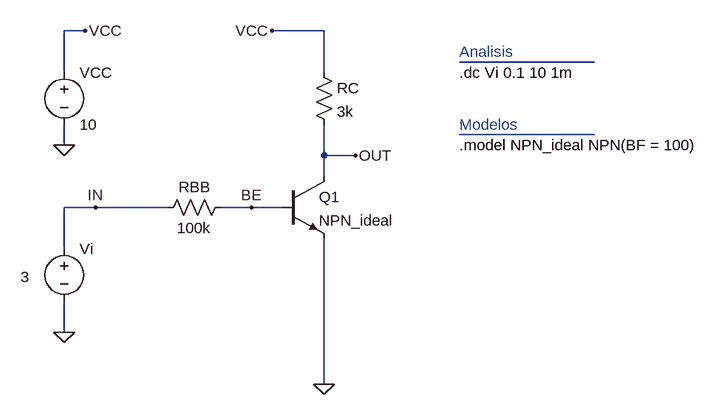
[diagram p0: schematic bjt_amp-ejemplo1_OP.asc]
bjt_amp-ejemplo1_OP.asc, the LTspice schematic file:
Version 4
SHEET 1 880 680
WIRE -288 -176 -320 -176
WIRE 80 -176 0 -176
WIRE 496 -128 288 -128
WIRE -320 -112 -320 -176
WIRE 80 -112 80 -176
WIRE 496 -16 288 -16
WIRE -320 0 -320 -32
WIRE 80 16 80 -32
WIRE 128 16 80 16
WIRE 80 48 80 16
WIRE -272 96 -320 96
WIRE -160 96 -272 96
WIRE -32 96 -80 96
WIRE 16 96 -32 96
WIRE -320 160 -320 96
WIRE -320 288 -320 240
WIRE 80 368 80 144
FLAG 80 368 0
FLAG -320 0 0
FLAG -288 -176 VCC
FLAG -320 288 0
FLAG 0 -176 VCC
FLAG 128 16 OUT
FLAG -272 96 IN
FLAG -32 96 BE
SYMBOL npn 16 48 R0
SYMATTR InstName Q1
SYMATTR Value NPN_ideal
SYMBOL res -176 112 R270
WINDOW 0 32 56 VTop 2
WINDOW 3 0 56 VBottom 2
SYMATTR InstName RBB
SYMATTR Value 100k
SYMBOL res 64 -128 R0
SYMATTR InstName RC
SYMATTR Value 3k
SYMBOL voltage -320 -128 R0
WINDOW 123 0 0 Left 0
WINDOW 39 0 0 Left 0
SYMATTR InstName VCC
SYMATTR Value 10
SYMBOL voltage -320 144 R0
WINDOW 3 -67 59 Left 2
WINDOW 123 0 0 Left 0
WINDOW 39 0 0 Left 0
SYMATTR Value 3
SYMATTR InstName Vi
TEXT 288 -144 Left 2 ;Analisis
TEXT 288 -112 Left 2 !.dc Vi 0.1 10 1m
TEXT 288 0 Left 2 !.model NPN_ideal NPN(BF = 100)
TEXT 288 -32 Left 2 ;Modelos

The netlist it stands for:
* bjt_amp-ejemplo1_OP.asc
Q1 OUT BE 0 0 NPN_ideal
RBB IN BE 100k
RC VCC OUT 3k
VCC VCC 0 10
Vi IN 0 3
.model NPN NPN
.model PNP PNP
.lib standard.bjt
* Analisis
.dc Vi 0.1 10 1m
.model NPN_ideal NPN(BF = 100)
* Modelos
.backanno
.end